# EAGLE schematic BPMLabTXDriver (EAGLE 7.5.0)
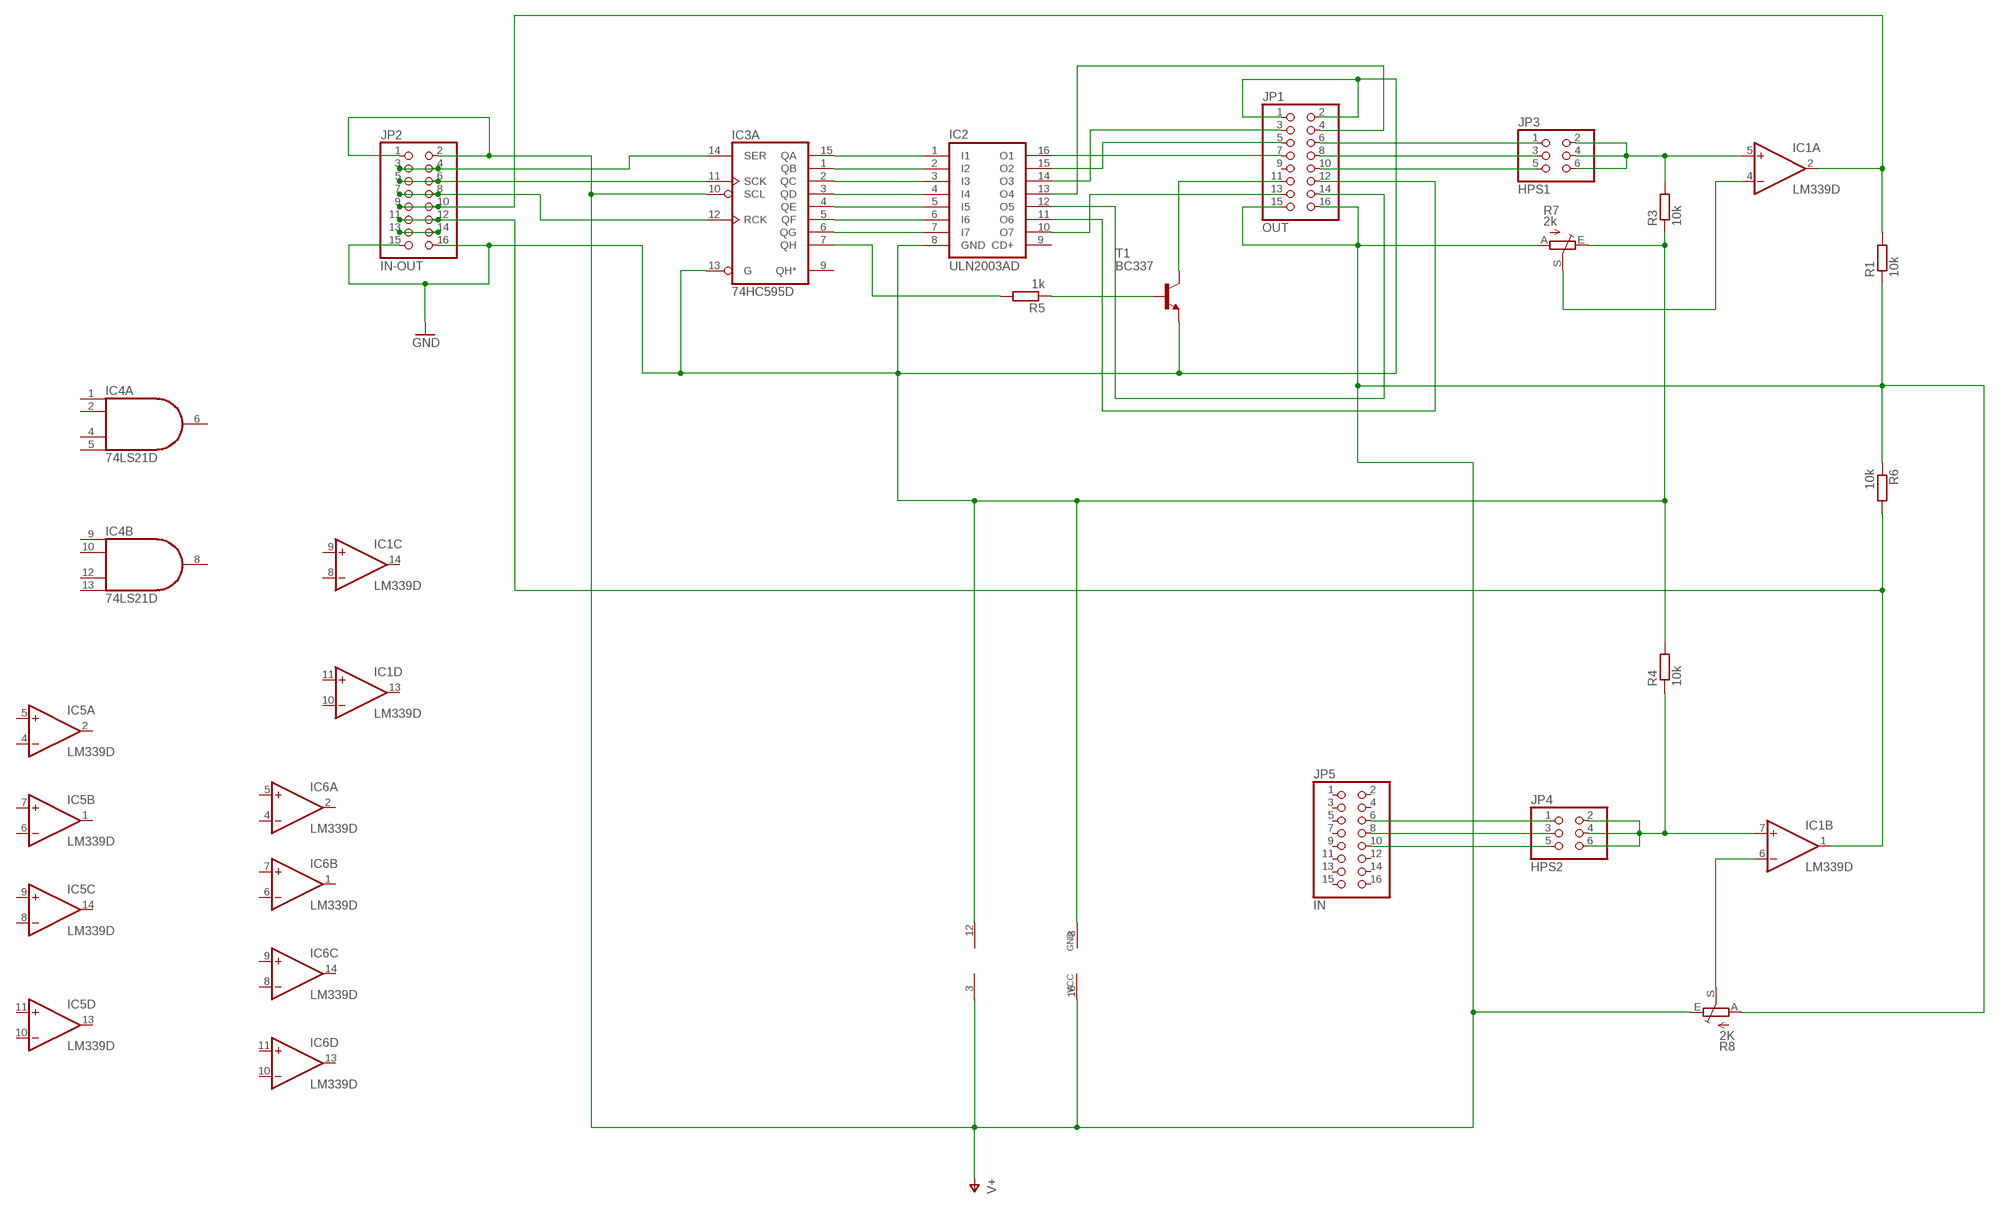
[diagram p0: schematic, sheet 1]

## Parts
IC1  LM339D  [SO14]
IC2  ULN2003AD  [SO16]
IC3  74HC595D  [SO16]
IC4  74LS21D  [SO14]
IC5  LM339D  [SO14]
IC6  LM339D  [SO14]
JP1  OUT  PINHD-2X8  [2X08]
JP2  IN-OUT  PINHD-2X8  [2X08]
JP3  HPS1  PINHD-2X3  [2X03]
JP4  HPS2  PINHD-2X3  [2X03]
JP5  IN  PINHD-2X8  [2X08]
R1  10k  R-EU_0207/10  [0207/10]
R3  10k  R-EU_0207/10  [0207/10]
R4  10k  R-EU_0207/10  [0207/10]
R5  1k  R-EU_0207/10  [0207/10]
R6  10k  R-EU_0207/10  [0207/10]
R7  2k  TRIM_EU-RS3  [RS3]
R8  2K  TRIM_EU-RS3  [RS3]
T1  BC337  BC337-16-NPN-TO92-CBE  [TO92-CBE]

## Nets
GND: IC1.12(P:GND) IC2.8(GND) IC3.8(P:GND) IC3.13(A:G) JP1.1 JP1.2 JP2.15 JP2.16 R3.1 R4.2 R7.E T1.E
N$1: JP1.6 JP3.1
N$2: JP1.8 JP3.3
N$3: JP1.10 JP3.5
N$4: IC1.5(A:+IN) JP3.2 JP3.4 JP3.6 R3.2
N$5: R5.1 T1.B
N$6: IC3.7(A:QH) R5.2
N$7: JP1.11 T1.C
N$8: JP4.1 JP5.6
N$9: JP4.3 JP5.8
N$10: JP4.5 JP5.10
N$11: IC1.7(B:+IN) JP4.2 JP4.4 JP4.6 R4.1
N$13: IC2.1(I1) IC3.15(A:QA)
N$15: IC1.4(A:-IN) R7.S
N$16: IC1.6(B:-IN) R8.S
N$19: IC3.14(A:SER) JP2.3 JP2.4
N$20: IC2.2(I2) IC3.1(A:QB)
N$21: IC2.3(I3) IC3.2(A:QC)
N$22: IC2.4(I4) IC3.3(A:QD)
N$23: IC2.5(I5) IC3.4(A:QE)
N$24: IC2.6(I6) IC3.5(A:QF)
N$25: IC2.7(I7) IC3.6(A:QG)
N$27: IC3.11(A:SCK) JP2.5 JP2.6
N$28: IC3.12(A:RCK) JP2.7 JP2.8
N$29: IC2.16(O1) JP1.7
N$30: IC2.15(O2) JP1.5
N$31: IC2.14(O3) JP1.3
N$32: IC2.13(O4) JP1.4
N$33: IC2.12(O5) JP1.14
N$34: IC2.11(O6) JP1.12
N$35: IC2.10(O7) JP1.13
N$36: IC1.2(A:OUT) JP2.9 JP2.10 R1.2
N$37: IC1.1(B:OUT) JP2.11 JP2.12 R6.2
N$38: JP2.13 JP2.14
V+: IC1.3(P:V+) IC3.10(A:SCL) IC3.16(P:VCC) JP1.15 JP1.16 JP2.1 JP2.2 R1.1 R6.1 R7.A R8.A R8.E
Unconnected: IC1.8(C:-IN) IC1.9(C:+IN) IC1.10(D:-IN) IC1.11(D:+IN) IC1.13(D:OUT) IC1.14(C:OUT) IC2.9(CD+) IC3.9(A:QH*) IC4.1(A:I0) IC4.2(A:I1) IC4.4(A:I2) IC4.5(A:I3) IC4.6(A:O) IC4.8(B:O) IC4.9(B:I0) IC4.10(B:I1) IC4.12(B:I2) IC4.13(B:I3) IC5.1(B:OUT) IC5.2(A:OUT) IC5.4(A:-IN) IC5.5(A:+IN) IC5.6(B:-IN) IC5.7(B:+IN) IC5.8(C:-IN) IC5.9(C:+IN) IC5.10(D:-IN) IC5.11(D:+IN) IC5.13(D:OUT) IC5.14(C:OUT) IC6.1(B:OUT) IC6.2(A:OUT) IC6.4(A:-IN) IC6.5(A:+IN) IC6.6(B:-IN) IC6.7(B:+IN) IC6.8(C:-IN) IC6.9(C:+IN) IC6.10(D:-IN) IC6.11(D:+IN) IC6.13(D:OUT) IC6.14(C:OUT) JP1.9 JP5.1 JP5.2 JP5.3 JP5.4 JP5.5 JP5.7 JP5.9 JP5.11 JP5.12 JP5.13 JP5.14 JP5.15 JP5.16

## Power pins joined to a net without a drawn wire
GND: IC4.7(P:GND) IC5.12(P:GND) IC6.12(P:GND)
V+: IC4.14(P:VCC) IC5.3(P:V+) IC6.3(P:V+)

## Library data of the parts
IC1 IC5 IC6 = linear:LM339: Low Power Low Offset Voltage Quad Comparators with open collector; LM139/LM239/LM339/LM2901/LM3302
IC2 = uln-udn:ULN2003A: DRIVER ARRAY
IC3 = 74xx-eu:74*595: 8-bit SHIFT REGISTER, output latch
IC4 = 74xx-us:74*21: Dual 4-input AND gate
JP1 JP2 JP5 = pinhead:PINHD-2X8: PIN HEADER
JP3 JP4 = pinhead:PINHD-2X3: PIN HEADER
R1 R3-R6 = resistor:R-EU_: RESISTOR, European symbol
R7 R8 = pot:TRIM_EU-: POTENTIOMETER
T1 = transistor:*-NPN-: NPN Transistror BF959 corrected 2008.03.06